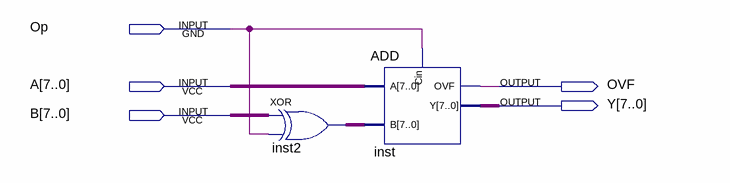
[diagram p0: schematic sheet]
// Quartus schematic ADDSUB.bdf as structural Verilog: 2 symbols, 5 pins
module ADDSUB (
  input  Op,
  input  [7:0] A,
  input  [7:0] B,
  output OVF,
  output [7:0] Y
);

  wire [7:0] inst2_out;

  assign inst2_out = B ^ {8{Op}};  // XOR inst2, 8 bits wide
  ADD inst (.A(A), .B(inst2_out), .Cin(Op), .Y(Y), .OVF(OVF));
endmodule
